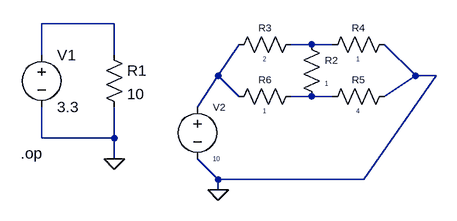
[diagram p0: schematic Draft1.asc]
Draft1.asc, the LTspice schematic file:
Version 4
SHEET 1 880 680
WIRE 96 16 -16 16
WIRE 400 48 368 48
WIRE 432 48 400 48
WIRE -16 64 -16 16
WIRE 96 64 96 16
WIRE 256 96 288 48
WIRE 560 96 512 48
WIRE 592 96 560 96
WIRE 288 128 256 96
WIRE 400 128 368 128
WIRE 432 128 400 128
WIRE 512 128 560 96
WIRE 224 144 256 96
WIRE -16 192 -16 144
WIRE 96 192 96 144
WIRE 96 192 -16 192
WIRE 96 224 96 192
WIRE 256 256 224 224
WIRE 480 256 592 96
WIRE 480 256 256 256
WIRE 256 272 256 256
FLAG 96 224 0
FLAG 256 272 0
SYMBOL res 80 48 R0
SYMATTR InstName R1
SYMATTR Value 10
SYMBOL voltage -16 48 R0
SYMATTR InstName V1
SYMATTR Value 3.3
SYMBOL res 384 32 R0
WINDOW 0 36 40 Left 1
WINDOW 3 36 76 Left 0
SYMATTR InstName R2
SYMATTR Value 1
SYMBOL res 384 32 R90
WINDOW 0 0 56 VBottom 1
WINDOW 3 32 56 VTop 0
SYMATTR InstName R3
SYMATTR Value 2
SYMBOL res 528 32 R90
WINDOW 0 0 56 VBottom 1
WINDOW 3 32 56 VTop 0
SYMATTR InstName R4
SYMATTR Value 1
SYMBOL res 528 112 R90
WINDOW 0 0 56 VBottom 1
WINDOW 3 32 56 VTop 0
SYMATTR InstName R5
SYMATTR Value 4
SYMBOL res 384 112 R90
WINDOW 0 0 56 VBottom 1
WINDOW 3 32 56 VTop 0
SYMATTR InstName R6
SYMATTR Value 1
SYMBOL voltage 224 128 R0
WINDOW 0 24 16 Left 1
WINDOW 3 24 96 Left 0
SYMATTR InstName V2
SYMATTR Value 10
TEXT -48 216 Left 2 !.op

The netlist it stands for:
* Draft1.asc
R1 N001 0 10
V1 N001 0 3.3
R2 N002 N004 1
R3 N002 N003 2
R4 0 N002 1
R5 0 N004 4
R6 N004 N003 1
V2 N003 0 10
.op
.backanno
.end